# Altium schematic sheet BalEv_SD_card_v1_0.SchDoc
size A4; CompanyName: HESSO; Address1: Route du Rawyl 47; Address2: 1950 Sion; Address3: Switzerland; DocumentNumber: 5; SheetNumber: 1; SheetTotal: 8; PageSetup: Record=PageOptions|CenterHorizontal=True|CenterVertical=True|PrintScale=1.00|XCorrection=1.00|YCorrection=1.00|PrintKind=1|BorderSize=5000000|LeftOffset=0|BottomOffset=0|Orientation=2|PaperLength=1000|PaperWidth=1000|Scale=100|PaperSource=15|PrintQuality=1200|MediaType=1|DitherType=10|PrintScaleMode=1|PaperKind=A4|PaperIndex=9; ProjectName: Project Name
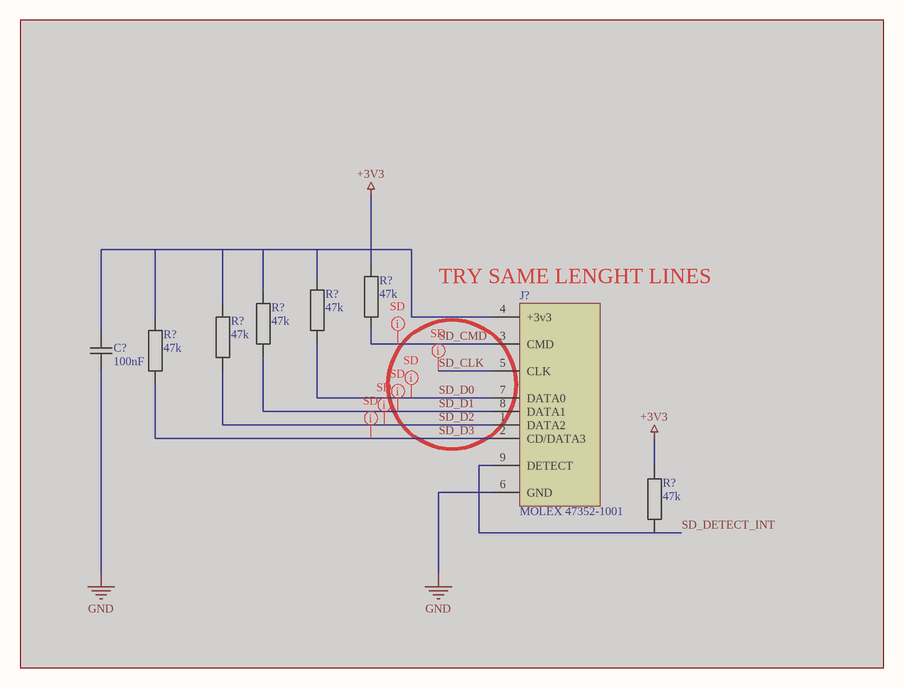
[diagram p0: BalEv_SD_card_v1_0.SchDoc]

## Parts
(Parts that share a designator on the sheet are numbered #1, #2 ... from top to bottom, then left to right.)
C?  100nF  [CAPACITOR 1005 REFLOW]  (masked out: inside a compile mask, not in the netlist)
J?  MOLEX 47352-1001  [SD MICRO MOLEX 47352-1001]  (masked out: inside a compile mask, not in the netlist)
R?#1  47k  [RESISTOR 1005 REFLOW]  (masked out: inside a compile mask, not in the netlist)
R?#2  47k  [RESISTOR 1005 REFLOW]  (masked out: inside a compile mask, not in the netlist)
R?#3  47k  [RESISTOR 1005 REFLOW]  (masked out: inside a compile mask, not in the netlist)
R?#4  47k  [RESISTOR 1005 REFLOW]  (masked out: inside a compile mask, not in the netlist)
R?#5  47k  [RESISTOR 1005 REFLOW]  (masked out: inside a compile mask, not in the netlist)
R?#6  47k  [RESISTOR 1005 REFLOW]  (masked out: inside a compile mask, not in the netlist)

## Layout directives
net class SD; rule Matched Net Lengths [Tolerance = 1mm]: (no net found under the mark)

## Notes on the sheet
- (near J?) TRY SAME LENGHT LINES
- Date :
- Revision :
- Sheet
- of
- Design by :

## Library data of the parts
C? = Capacitor: Value: 100nF; STOCK: NO
J? = SD-MICRO MOLEX 47352-1001: SD Card  Micro 47352-1001; Value: MOLEX 47352-1001; STOCK: YES
R?#1-R?#6 = Resistor: Value: 47k; STOCK: NO